# EasyEDA Pro project 通用采样.eprj, schematic 互感器
Board Name: 互感器; Create Date: 2025-08-22; Page Name: P1; Project Name: 通用采样; Schematic Name: 互感器; Update Date: 2025-08-23; Company: 嘉立创EDA; Page Size: A4; Version: V1.0
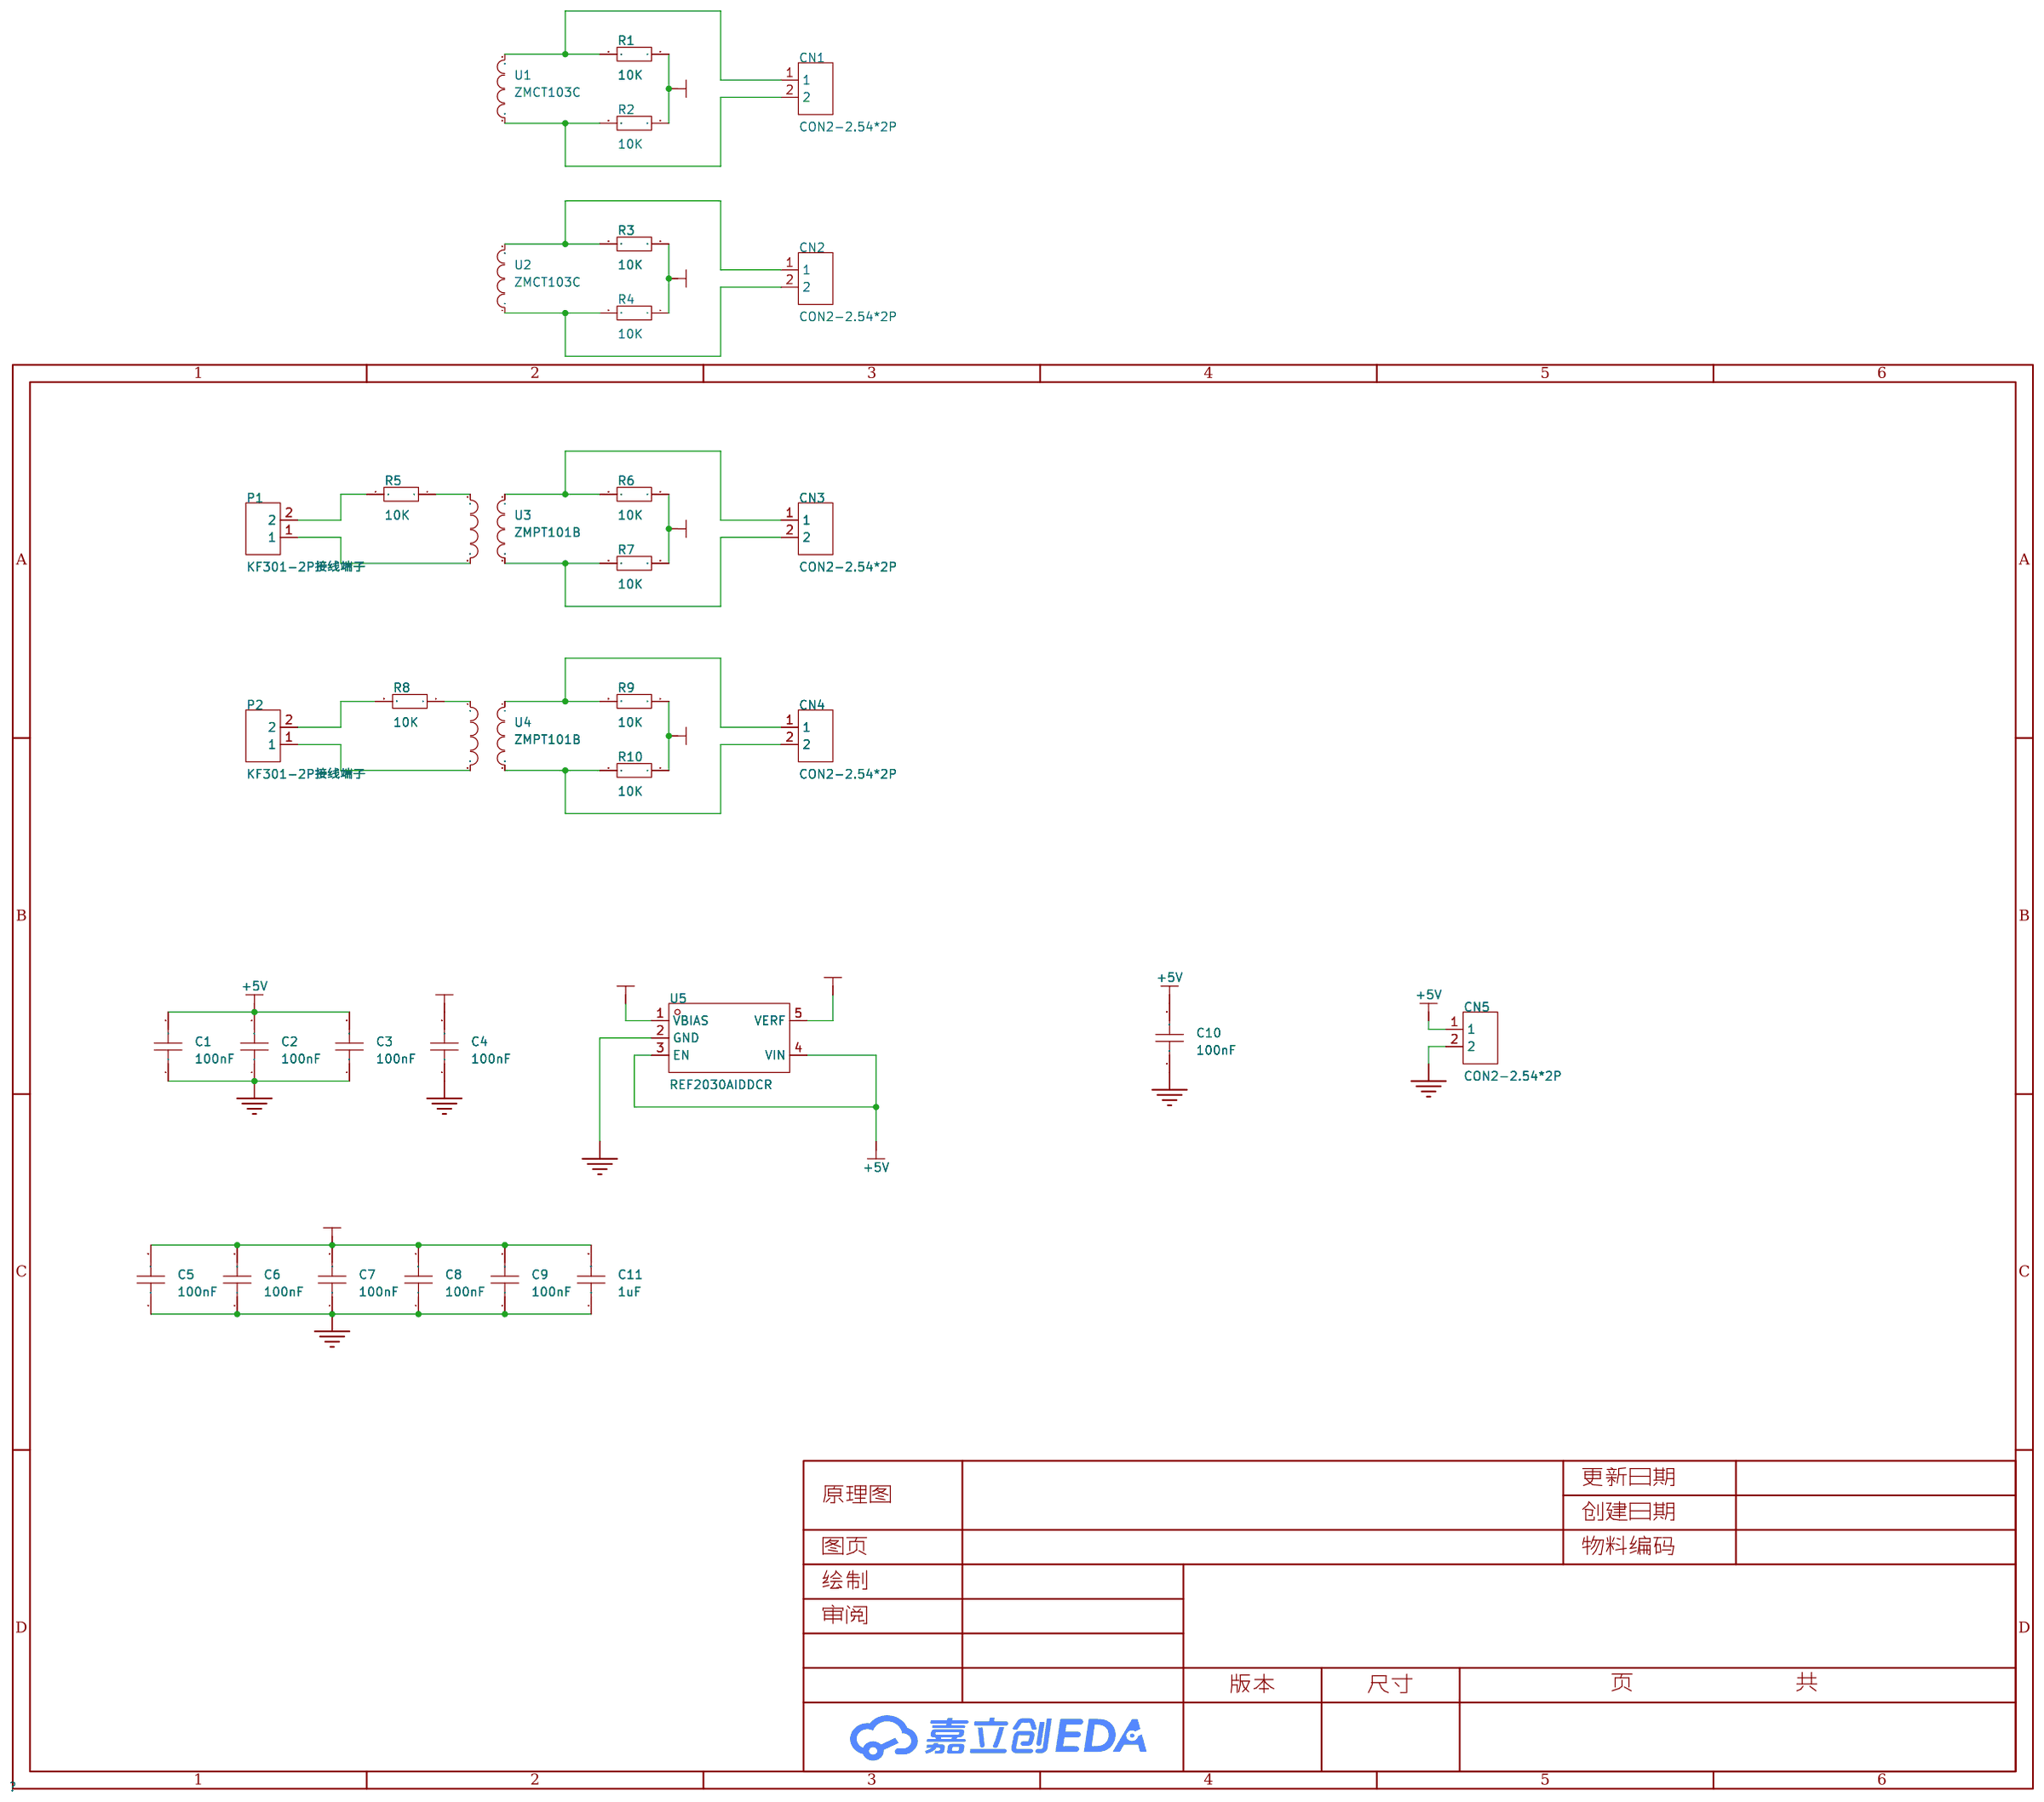
[diagram p3: schematic sheet]

## Parts
C1  100nF  [C0805]
C2  100nF  [C0805]
C3  100nF  [C0805]
C4  100nF  [C0805]
C5  100nF  [C0805]
C6  100nF  [C0805]
C7  100nF  [C0805]
C8  100nF  [C0805]
C9  100nF  [C0805]
C10  100nF  [C0805]
C11  1uF  [C0805]
CN1  CON2-2.54*2P  [CONN-TH_2P-P2.54-V]
CN2  CON2-2.54*2P  [CONN-TH_2P-P2.54-V]
CN3  CON2-2.54*2P  [CONN-TH_2P-P2.54-V]
CN4  CON2-2.54*2P  [CONN-TH_2P-P2.54-V]
CN5  CON2-2.54*2P  [CONN-TH_2P-P2.54-V]
P1  KF301-2P接线端子  [CONN-TH_XY301V-A-5.0-2P]
P2  KF301-2P接线端子  [CONN-TH_XY301V-A-5.0-2P]
R1  10K  [R0805]
R2  10K  [R0805]
R3  10K  [R0805]
R4  10K  [R0805]
R5  10K  [R0805]
R6  10K  [R0805]
R7  10K  [R0805]
R8  10K  [R0805]
R9  10K  [R0805]
R10  10K  [R0805]
U1  ZMCT103C  [XFMR-TH_ZMCT103C]
U2  ZMCT103C  [XFMR-TH_ZMCT103C]
U3  ZMPT101B  [XFMR-TH_ZMPT101B]
U4  ZMPT101B  [XFMR-TH_ZMPT101B]
U5  REF2030AIDDCR  [SOT-23-5_L2.9-W1.6-P0.95-LS2.8-BL]

## Library data of the parts
C1-C11 = CAP_0805: Supplier Footprint: 0805
CN1-CN5 = CON2-2.54*2P: Supplier Part: C9900003238; Supplier Footprint: TH-2P; JLCPCB Part Class: Extended Part; Supplier: LCSC
P1 P2 = KF301-2P接线端子: Supplier Part: C9900016950; Supplier Footprint: CK301-2P; JLCPCB Part Class: Extended Part; Supplier: LCSC
R1-R10 = Res_0805: Supplier Footprint: 0805
U1 U2 = ZMCT103C: LCSC Part Name: 蓝色 A类 ZMCT103C; Supplier Part: C94571; Manufacturer: 择明朗熙; Supplier Footprint: 插件; JLCPCB Part Class: 扩展库; Datasheet: https://atta.szlcsc.com/upload/public/pdf/source/20220302/0716E7B8D044EDA292B4198B83E25333.pdf; Supplier: LCSC; Type: 电流互感器
U3 U4 = ZMPT101B: Supplier Part: C111858; Manufacturer: 择明朗熙; Supplier Footprint: 插件; JLCPCB Part Class: 扩展库; Datasheet: https://atta.szlcsc.com/upload/public/pdf/source/20180620/C111858_8009DF6588FC1E1F0188704039E5D8C5.pdf; Supplier: LCSC
U5 = REF2030AIDDCR: 输出类型:固定;输入电压:3.02V~5.5V;输出电压:1.5V；3V;输出电流:20mA;精度:±0.05%;; Supplier Part: C528704; Manufacturer: TI(德州仪器); Supplier Footprint: SOT-23-5; JLCPCB Part Class: 扩展库; Datasheet: https://www.ti.com/cn/lit/gpn/ref2030; Supplier: LCSC; Output Type: 固定; Input Voltage: 3.02V~5.5V; Output Voltage: 1.5V；3V; Output Current: 20mA; Tolerance: ±0.05%; Temperature Coefficient: 8ppm/℃; Reference Type: 串联; Supply Current: 460uA; Noise - 1/10Hz to 10Hz: 12ppmp-p; Operating Temperature: -40℃~+125℃@(Ta)

## Nets
3V: C4.2 U5.5(VERF)
+1.5V: C5.2 C6.2 C7.2 C8.2 C9.2 C11.2 R1.1 R2.1 R3.1 R4.1 R6.1 R7.1 R9.1 R10.1 U5.1(VBIAS)
+5V: C1.2 C2.2 C3.2 C10.2 CN5.1 U5.3(EN) U5.4(VIN)
GND: C1.1 C2.1 C3.1 C4.1 C5.1 C6.1 C7.1 C8.1 C9.1 C10.1 C11.1 CN5.2 U5.2(GND)
$1N495: CN1.1 R1.2 U1.2
$1N507: CN1.2 R2.2 U1.1
$1N515: CN2.1 R3.2 U2.2
$1N524: CN2.2 R4.2 U2.1
$1N529: CN3.1 R6.2 U3.4
$1N534: CN3.2 R7.2 U3.3
$1N544: CN4.1 R9.2 U4.4
$1N549: CN4.2 R10.2 U4.3
$1N697: P1.2 R5.2
$1N703: R5.1 U3.1
$1N708: P1.1 U3.2
$1N718: R8.1 U4.1
$1N2944: P2.1 U4.2
$1N2949: P2.2 R8.2
